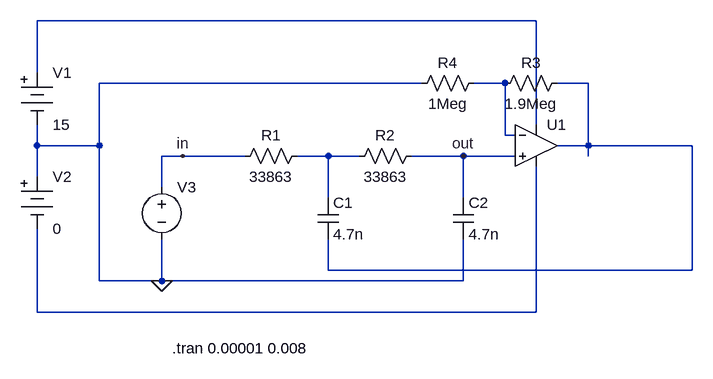
[diagram p0: schematic SKF2_universal.asc]
SKF2_universal.asc, the LTspice schematic file:
Version 4
SHEET 1 996 680
WIRE 752 64 -16 64
WIRE -16 144 -16 64
WIRE 576 160 80 160
WIRE 704 160 656 160
WIRE 832 160 784 160
WIRE 752 224 752 64
WIRE 704 240 704 160
WIRE 720 240 704 240
WIRE -16 256 -16 224
WIRE 80 256 80 160
WIRE 80 256 -16 256
WIRE 832 256 832 160
WIRE 832 256 784 256
WIRE 992 256 832 256
WIRE 208 272 176 272
WIRE 304 272 208 272
WIRE 432 272 384 272
WIRE 480 272 432 272
WIRE 640 272 560 272
WIRE 720 272 640 272
WIRE 832 272 832 256
WIRE -16 304 -16 256
WIRE 176 320 176 272
WIRE 432 336 432 272
WIRE 640 336 640 272
WIRE 432 448 432 400
WIRE 992 448 992 256
WIRE 992 448 432 448
WIRE 80 464 80 256
WIRE 176 464 176 400
WIRE 176 464 80 464
WIRE 640 464 640 400
WIRE 640 464 176 464
WIRE -16 512 -16 384
WIRE 752 512 752 288
WIRE 752 512 -16 512
FLAG 176 464 0
FLAG 640 272 out
FLAG 208 272 in
SYMBOL Misc/battery -16 128 R0
SYMATTR InstName V1
SYMATTR Value 15
SYMBOL Misc/battery -16 288 R0
SYMATTR InstName V2
SYMATTR Value 0
SYMBOL voltage 176 304 R0
WINDOW 3 24 96 Invisible 2
SYMATTR Value PWL(0 0 0.00001 1 0.002 1 0.00201 -1 0.004 -1 0.00401 1 0.006 1 0.00601 -1 0.008 -1 0.00801 1)
SYMATTR InstName V3
SYMBOL res 400 256 R90
WINDOW 0 0 56 VBottom 2
WINDOW 3 32 56 VTop 2
SYMATTR InstName R1
SYMATTR Value 33863
SYMBOL res 576 256 R90
WINDOW 0 0 56 VBottom 2
WINDOW 3 32 56 VTop 2
SYMATTR InstName R2
SYMATTR Value 33863
SYMBOL cap 416 336 R0
SYMATTR InstName C1
SYMATTR Value 4.7n
SYMBOL cap 624 336 R0
SYMATTR InstName C2
SYMATTR Value 4.7n
SYMBOL res 800 144 R90
WINDOW 0 0 56 VBottom 2
WINDOW 3 32 56 VTop 2
SYMATTR InstName R3
SYMATTR Value 1.9Meg
SYMBOL res 672 144 R90
WINDOW 0 0 56 VBottom 2
WINDOW 3 32 56 VTop 2
SYMATTR InstName R4
SYMATTR Value 1Meg
SYMBOL Opamps/UniversalOpamp2 752 256 R0
SYMATTR InstName U1
TEXT 192 568 Left 2 !.tran 0.00001 0.008

The netlist it stands for:
* SKF2_universal.asc
V1 N001 0 15
V2 0 N005 0
V3 in 0 PWL(0 0 0.00001 1 0.002 1 0.00201 -1 0.004 -1 0.00401 1 0.006 1 0.00601 -1 0.008 -1 0.00801 1)
R1 N004 in 33863
R2 out N004 33863
C1 N004 N003 4.7n
C2 out 0 4.7n
R3 N003 N002 1.9Meg
R4 N002 0 1Meg
XU1 out N002 N001 N005 N003 level.2 Avol=1Meg GBW=10Meg Slew=10Meg ilimit=25m rail=0 Vos=0 phimargin=45 en=0 enk=0 in=0 ink=0 Rin=500Meg  ; pins IN+ IN- V+ V- OUT
.tran 0.00001 0.008
.lib UniversalOpamps2.sub
.backanno
.end